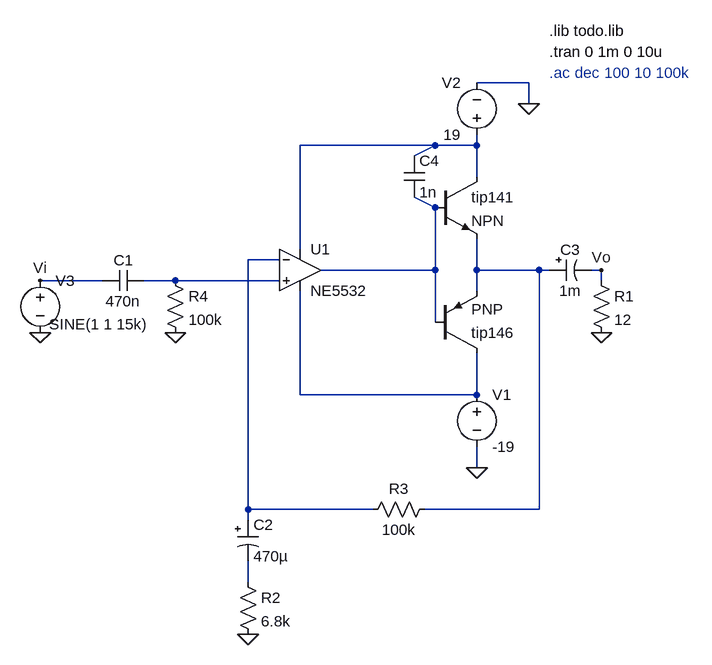
[diagram p0: schematic amplificador_completo.asc]
amplificador_completo.asc, the LTspice schematic file:
Version 4
SHEET 1 1164 1008
WIRE 608 144 528 144
WIRE 608 176 608 144
WIRE 464 240 256 240
WIRE 528 240 528 224
WIRE 528 240 464 240
WIRE 432 256 464 240
WIRE 528 288 528 240
WIRE 464 336 432 320
WIRE 256 400 256 240
WIRE 224 416 176 416
WIRE 464 432 464 336
WIRE 464 432 288 432
WIRE 528 432 528 384
WIRE 624 432 528 432
WIRE 640 432 624 432
WIRE 720 432 704 432
WIRE -48 448 -144 448
WIRE 64 448 16 448
WIRE 224 448 64 448
WIRE 720 448 720 432
WIRE 528 464 528 432
WIRE 464 512 464 432
WIRE 256 624 256 464
WIRE 528 624 528 560
WIRE 528 624 256 624
WIRE 528 736 528 704
WIRE 176 800 176 416
WIRE 368 800 176 800
WIRE 624 800 624 432
WIRE 624 800 448 800
WIRE 176 816 176 800
WIRE 176 912 176 880
FLAG 608 176 0
FLAG 528 736 0
FLAG -144 528 0
FLAG 720 432 Vo
FLAG -144 448 Vi
FLAG 720 528 0
FLAG 176 992 0
FLAG 64 528 0
SYMBOL pnp 464 560 M180
SYMATTR InstName tip146
SYMBOL voltage 528 608 R0
SYMATTR InstName V1
SYMATTR Value -19
SYMBOL voltage 528 240 R180
WINDOW 0 24 96 Left 2
WINDOW 3 24 16 Left 2
SYMATTR InstName V2
SYMATTR Value 19
SYMBOL voltage -144 432 R0
WINDOW 3 14 83 Left 2
SYMATTR Value SINE(1 1 15k)
SYMATTR InstName V3
SYMATTR Value2 AC 1 0
SYMBOL res 704 432 R0
SYMATTR InstName R1
SYMATTR Value 12
SYMBOL OpAmps/opamp2 256 368 R0
SYMATTR InstName U1
SYMATTR Value NE5532
SYMBOL res 160 896 R0
SYMATTR InstName R2
SYMATTR Value 6.8k
SYMBOL res 464 784 R90
WINDOW 0 0 56 VBottom 2
WINDOW 3 32 56 VTop 2
SYMATTR InstName R3
SYMATTR Value 100k
SYMBOL cap 16 432 R90
WINDOW 0 0 32 VBottom 2
WINDOW 3 32 32 VTop 2
SYMATTR InstName C1
SYMATTR Value 470n
SYMATTR SpiceLine Rser=0 Lser=0 mfg="Murata" pn="GRM033R61C104KE14" type="X5R"
SYMBOL res 48 432 R0
SYMATTR InstName R4
SYMATTR Value 100k
SYMBOL npn 464 288 R0
SYMATTR InstName tip141
SYMBOL polcap 160 816 R0
WINDOW 3 24 56 Left 2
SYMATTR Value 470µ
SYMATTR InstName C2
SYMATTR Description Capacitor
SYMATTR Type cap
SYMATTR SpiceLine Rser=8.7m Lser=7.838n mfg="Würth Elektronik" pn="870135375007 WCAP-PTHT 10 x 12,5" type="Al polymer"
SYMBOL polcap 640 416 M90
WINDOW 0 0 32 VBottom 2
WINDOW 3 32 32 VTop 2
SYMATTR InstName C3
SYMATTR Value 1m
SYMATTR Description Capacitor
SYMATTR Type cap
SYMATTR SpiceLine Rser=86m Lser=26.8n mfg="Würth Elektronik" pn="860020475018 WCAP-ATG5 10x20" type="Al electrolytic"
SYMBOL cap 416 256 R0
SYMATTR InstName C4
SYMATTR Value 1n
SYMATTR SpiceLine Rser=0 Lser=0 mfg="Murata" pn="GRM1555C1H102JA01" type="C0G"
TEXT 640 96 Left 2 !.tran 0 1m 0 10u
TEXT 640 64 Left 2 !.lib todo.lib
TEXT 640 128 Left 2 ;.ac dec 100 10 100k

The netlist it stands for:
* amplificador_completo.asc
Q§tip146 N006 N002 N004 0 PNP
V1 N006 0 -19
V2 N001 0 19
V3 Vi 0 SINE(1 1 15k) AC 1 0
R1 Vo 0 12
XU1 N005 N003 N001 N006 N002 NE5532  ; pins In+ In- V+ V- OUT
R2 N007 0 6.8k
R3 N004 N003 100k
C1 N005 Vi 470n Rser=0 Lser=0 mfg="Murata" pn="GRM033R61C104KE14" type="X5R"
R4 N005 0 100k
Q§tip141 N001 N002 N004 0 NPN
C2 N003 N007 470µ Rser=8.7m Lser=7.838n mfg="Würth Elektronik" pn="870135375007 WCAP-PTHT 10 x 12,5" type="Al polymer"
C3 N004 Vo 1m Rser=86m Lser=26.8n mfg="Würth Elektronik" pn="860020475018 WCAP-ATG5 10x20" type="Al electrolytic"
C4 N001 N002 1n Rser=0 Lser=0 mfg="Murata" pn="GRM1555C1H102JA01" type="C0G"
.model NPN NPN
.model PNP PNP
.lib standard.bjt
.tran 0 1m 0 10u
.lib todo.lib
* .ac dec 100 10 100k
.backanno
.end